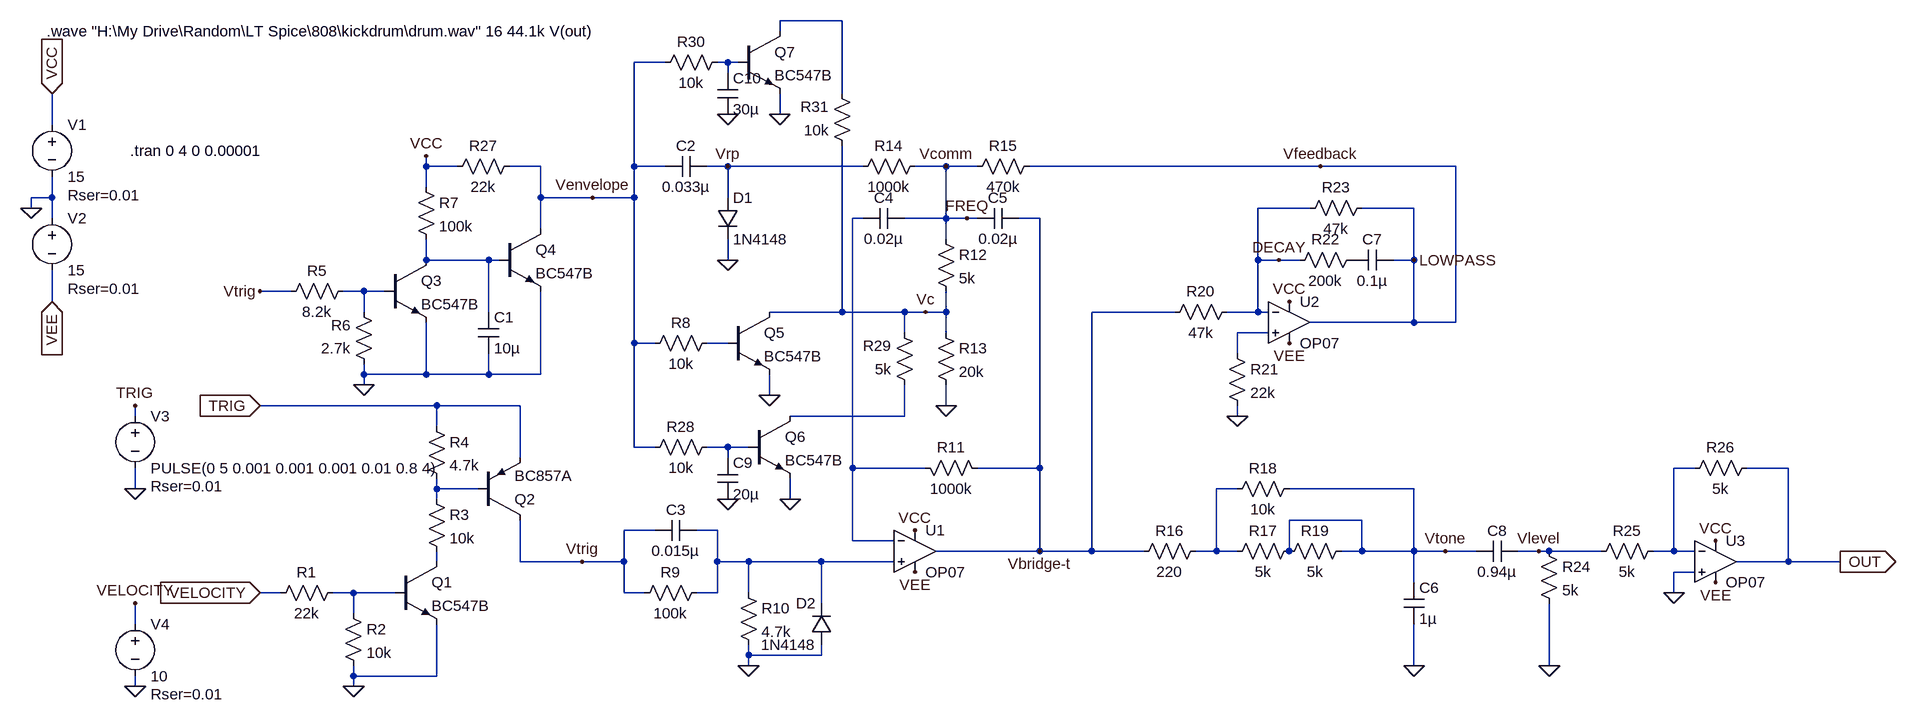
[diagram p0: schematic Drum.asc]
Drum.asc, the LTspice schematic file:
Version 4
SHEET 1 3084 1236
WIRE 1168 -80 1072 -80
WIRE 1072 -64 1072 -80
WIRE 896 -16 848 -16
WIRE 992 -16 976 -16
WIRE 1008 -16 992 -16
WIRE 992 0 992 -16
WIRE 1168 32 1168 -80
WIRE 1072 64 1072 32
WIRE -48 80 -48 32
WIRE 528 144 528 128
WIRE 576 144 528 144
WIRE 704 144 656 144
WIRE 848 144 848 -16
WIRE 896 144 848 144
WIRE 992 144 960 144
WIRE 1200 144 992 144
WIRE 1328 144 1280 144
WIRE 1376 144 1328 144
WIRE 1904 144 1456 144
WIRE 2112 144 1904 144
WIRE 528 176 528 144
WIRE -48 192 -48 160
WIRE -48 192 -80 192
WIRE 704 192 704 144
WIRE 784 192 704 192
WIRE 848 192 848 144
WIRE 848 192 784 192
WIRE 992 192 992 144
WIRE -80 208 -80 192
WIRE 1888 208 1808 208
WIRE 2048 208 1968 208
WIRE -48 224 -48 192
WIRE 1200 224 1184 224
WIRE 1328 224 1328 144
WIRE 1328 224 1264 224
WIRE 1360 224 1328 224
WIRE 1376 224 1360 224
WIRE 1472 224 1440 224
WIRE 704 240 704 192
WIRE 1328 256 1328 224
WIRE 528 288 528 256
WIRE 624 288 528 288
WIRE 640 288 624 288
WIRE 992 288 992 256
WIRE 1808 288 1808 208
WIRE 1840 288 1808 288
WIRE 1872 288 1840 288
WIRE 2048 288 2048 208
WIRE 2048 288 2016 288
WIRE 320 336 272 336
WIRE 432 336 400 336
WIRE 464 336 432 336
WIRE -48 352 -48 304
WIRE 432 368 432 336
WIRE 624 368 624 288
WIRE 1168 368 1168 112
WIRE 1168 368 1056 368
WIRE 1264 368 1168 368
WIRE 1296 368 1264 368
WIRE 1328 368 1328 336
WIRE 1328 368 1296 368
WIRE 1680 368 1552 368
WIRE 1808 368 1808 288
WIRE 1808 368 1760 368
WIRE 1824 368 1808 368
WIRE 2048 384 2048 288
WIRE 2048 384 1888 384
WIRE 2112 384 2112 144
WIRE 2112 384 2048 384
WIRE 1264 400 1264 368
WIRE 1328 400 1328 368
WIRE 1824 400 1776 400
WIRE 848 416 848 192
WIRE 880 416 848 416
WIRE 992 416 960 416
WIRE 1776 432 1776 400
WIRE 432 464 432 448
WIRE 528 464 528 384
WIRE 528 464 432 464
WIRE 624 464 624 432
WIRE 624 464 528 464
WIRE 704 464 704 336
WIRE 704 464 624 464
WIRE 432 480 432 464
WIRE 1056 496 1056 464
WIRE 544 512 272 512
WIRE 672 512 544 512
WIRE 1328 512 1328 480
WIRE 80 528 80 512
WIRE 1264 528 1264 480
WIRE 1264 528 1088 528
WIRE 1776 528 1776 512
WIRE 544 544 544 512
WIRE 848 576 848 416
WIRE 880 576 848 576
WIRE 992 576 960 576
WIRE 1024 576 992 576
WIRE 672 592 672 512
WIRE 992 592 992 576
WIRE 1184 608 1184 224
WIRE 1296 608 1184 608
WIRE 1472 608 1472 224
WIRE 1472 608 1376 608
WIRE 2480 608 2448 608
WIRE 2624 608 2560 608
WIRE 80 640 80 608
WIRE 544 640 544 624
WIRE 608 640 544 640
WIRE 1776 640 1744 640
WIRE 2048 640 1856 640
WIRE 544 656 544 640
WIRE 1088 656 1088 624
WIRE 1968 688 1856 688
WIRE 880 704 832 704
WIRE 976 704 944 704
WIRE 1184 720 1184 608
WIRE 1248 720 1184 720
WIRE 1472 736 1472 608
WIRE 1472 736 1312 736
WIRE 1552 736 1552 368
WIRE 1552 736 1472 736
WIRE 1632 736 1552 736
WIRE 1744 736 1744 640
WIRE 1744 736 1712 736
WIRE 1776 736 1744 736
WIRE 1856 736 1856 688
WIRE 1968 736 1968 688
WIRE 1968 736 1936 736
WIRE 2048 736 2048 640
WIRE 2048 736 1968 736
WIRE 2096 736 2048 736
WIRE 2144 736 2096 736
WIRE 2240 736 2208 736
WIRE 2256 736 2240 736
WIRE 2336 736 2256 736
WIRE 2448 736 2448 608
WIRE 2448 736 2416 736
WIRE 2480 736 2448 736
WIRE 544 752 544 736
WIRE 672 752 672 688
WIRE 768 752 672 752
WIRE 832 752 832 704
WIRE 832 752 768 752
WIRE 976 752 976 704
WIRE 1024 752 976 752
WIRE 1136 752 1024 752
WIRE 1248 752 1136 752
WIRE 2624 752 2624 608
WIRE 2624 752 2544 752
WIRE 2704 752 2624 752
WIRE 2480 768 2448 768
WIRE 2048 784 2048 736
WIRE 304 800 272 800
WIRE 416 800 384 800
WIRE 480 800 416 800
WIRE 832 800 832 752
WIRE 864 800 832 800
WIRE 976 800 976 752
WIRE 976 800 944 800
WIRE 1024 800 1024 752
WIRE 2448 800 2448 768
WIRE 1136 816 1136 752
WIRE 416 832 416 800
WIRE 80 848 80 816
WIRE 1024 896 1024 880
WIRE 1136 896 1136 880
WIRE 1136 896 1024 896
WIRE 1024 912 1024 896
WIRE 2048 912 2048 848
WIRE 2256 912 2256 816
WIRE 416 928 416 912
WIRE 544 928 544 848
WIRE 544 928 416 928
WIRE 80 944 80 928
WIRE 416 944 416 928
FLAG -48 352 VEE
IOPIN -48 352 In
FLAG -48 32 VCC
IOPIN -48 32 In
FLAG -80 208 0
FLAG 272 512 TRIG
IOPIN 272 512 In
FLAG 272 800 VELOCITY
IOPIN 272 800 In
FLAG 416 944 0
FLAG 768 752 Vtrig
FLAG 432 480 0
FLAG 272 336 Vtrig
FLAG 528 128 VCC
FLAG 784 192 Venvelope
FLAG 1056 496 0
FLAG 992 288 0
FLAG 992 144 Vrp
FLAG 1024 912 0
FLAG 1328 512 0
FLAG 1472 736 Vbridge-t
FLAG 2048 912 0
FLAG 1328 144 Vcomm
FLAG 1296 368 Vc
FLAG 1776 528 0
FLAG 1280 704 VCC
FLAG 1856 352 VCC
FLAG 1280 768 VEE
FLAG 1856 416 VEE
FLAG 2240 736 Vlevel
FLAG 2096 736 Vtone
FLAG 2704 752 OUT
IOPIN 2704 752 Out
FLAG 80 640 0
FLAG 80 512 TRIG
FLAG 80 944 0
FLAG 80 816 VELOCITY
FLAG 1904 144 Vfeedback
FLAG 2256 912 0
FLAG 2448 800 0
FLAG 2512 784 VEE
FLAG 2512 720 VCC
FLAG 1840 288 DECAY
FLAG 2048 288 LOWPASS
FLAG 1360 224 FREQ
FLAG 992 656 0
FLAG 1088 656 0
FLAG 1072 64 0
FLAG 992 64 0
SYMBOL voltage -48 64 R0
WINDOW 123 0 0 Left 2
WINDOW 39 24 124 Left 2
SYMATTR SpiceLine Rser=0.01
SYMATTR InstName V1
SYMATTR Value 15
SYMBOL voltage -48 208 R0
WINDOW 123 0 0 Left 2
WINDOW 39 24 124 Left 2
SYMATTR SpiceLine Rser=0.01
SYMATTR InstName V2
SYMATTR Value 15
SYMBOL res 400 784 R90
WINDOW 0 0 56 VBottom 2
WINDOW 3 32 56 VTop 2
SYMATTR InstName R1
SYMATTR Value 22k
SYMBOL res 400 816 R0
SYMATTR InstName R2
SYMATTR Value 10k
SYMBOL npn 480 752 R0
SYMATTR InstName Q1
SYMATTR Value BC547B
SYMBOL res 528 640 R0
SYMATTR InstName R3
SYMATTR Value 10k
SYMBOL res 528 528 R0
SYMATTR InstName R4
SYMATTR Value 4.7k
SYMBOL pnp 608 688 M180
SYMATTR InstName Q2
SYMATTR Value BC857A
SYMBOL res 416 320 R90
WINDOW 0 0 56 VBottom 2
WINDOW 3 32 56 VTop 2
SYMATTR InstName R5
SYMATTR Value 8.2k
SYMBOL res 448 464 R180
WINDOW 0 36 76 Left 2
WINDOW 3 36 40 Left 2
SYMATTR InstName R6
SYMATTR Value 2.7k
SYMBOL npn 464 288 R0
SYMATTR InstName Q3
SYMATTR Value BC547B
SYMBOL npn 640 240 R0
SYMATTR InstName Q4
SYMATTR Value BC547B
SYMBOL cap 608 368 R0
SYMATTR InstName C1
SYMATTR Value 10µ
SYMBOL res 512 160 R0
SYMATTR InstName R7
SYMATTR Value 100k
SYMBOL res 976 400 R90
WINDOW 0 0 56 VBottom 2
WINDOW 3 32 56 VTop 2
SYMATTR InstName R8
SYMATTR Value 10k
SYMBOL npn 992 368 R0
SYMATTR InstName Q5
SYMATTR Value BC547B
SYMBOL cap 960 128 R90
WINDOW 0 0 32 VBottom 2
WINDOW 3 32 32 VTop 2
SYMATTR InstName C2
SYMATTR Value 0.033µ
SYMBOL diode 976 192 R0
SYMATTR InstName D1
SYMATTR Value 1N4148
SYMBOL cap 944 688 R90
WINDOW 0 0 32 VBottom 2
WINDOW 3 32 32 VTop 2
SYMATTR InstName C3
SYMATTR Value 0.015µ
SYMBOL res 960 784 R90
WINDOW 0 0 56 VBottom 2
WINDOW 3 32 56 VTop 2
SYMATTR InstName R9
SYMATTR Value 100k
SYMBOL res 1008 784 R0
SYMATTR InstName R10
SYMATTR Value 4.7k
SYMBOL diode 1152 880 R180
WINDOW 0 24 64 Left 2
WINDOW 3 24 0 Left 2
SYMATTR InstName D2
SYMATTR Value 1N4148
SYMBOL Opamps\\OP07 1280 672 R0
SYMATTR InstName U1
SYMBOL res 1280 592 M90
WINDOW 0 0 56 VBottom 2
WINDOW 3 32 56 VTop 2
SYMATTR InstName R11
SYMATTR Value 1000k
SYMBOL cap 1264 208 R90
WINDOW 0 0 32 VBottom 2
WINDOW 3 32 32 VTop 2
SYMATTR InstName C4
SYMATTR Value 0.02µ
SYMBOL cap 1440 208 R90
WINDOW 0 0 32 VBottom 2
WINDOW 3 32 32 VTop 2
SYMATTR InstName C5
SYMATTR Value 0.02µ
SYMBOL res 1312 240 R0
SYMATTR InstName R12
SYMATTR Value 5k
SYMBOL res 1312 384 R0
SYMATTR InstName R13
SYMATTR Value 20k
SYMBOL res 1296 128 R90
WINDOW 0 0 56 VBottom 2
WINDOW 3 32 56 VTop 2
SYMATTR InstName R14
SYMATTR Value 1000k
SYMBOL res 1472 128 R90
WINDOW 0 0 56 VBottom 2
WINDOW 3 32 56 VTop 2
SYMATTR InstName R15
SYMATTR Value 470k
SYMBOL res 1728 720 R90
WINDOW 0 0 56 VBottom 2
WINDOW 3 32 56 VTop 2
SYMATTR InstName R16
SYMATTR Value 220
SYMBOL res 1872 720 R90
WINDOW 0 0 56 VBottom 2
WINDOW 3 32 56 VTop 2
SYMATTR InstName R17
SYMATTR Value 5k
SYMBOL res 1872 624 R90
WINDOW 0 0 56 VBottom 2
WINDOW 3 32 56 VTop 2
SYMATTR InstName R18
SYMATTR Value 10k
SYMBOL res 1952 720 R90
WINDOW 0 0 56 VBottom 2
WINDOW 3 32 56 VTop 2
SYMATTR InstName R19
SYMATTR Value 5k
SYMBOL cap 2032 784 R0
SYMATTR InstName C6
SYMATTR Value 1µ
SYMBOL res 1776 352 R90
WINDOW 0 0 56 VBottom 2
WINDOW 3 32 56 VTop 2
SYMATTR InstName R20
SYMATTR Value 47k
SYMBOL Opamps\\OP07 1856 320 R0
SYMATTR InstName U2
SYMBOL res 1760 416 R0
SYMATTR InstName R21
SYMATTR Value 22k
SYMBOL res 1968 272 R90
WINDOW 0 0 56 VBottom 2
WINDOW 3 32 56 VTop 2
SYMATTR InstName R22
SYMATTR Value 200k
SYMBOL cap 2016 272 R90
WINDOW 0 0 32 VBottom 2
WINDOW 3 32 32 VTop 2
SYMATTR InstName C7
SYMATTR Value 0.1µ
SYMBOL res 1984 192 R90
WINDOW 0 0 56 VBottom 2
WINDOW 3 32 56 VTop 2
SYMATTR InstName R23
SYMATTR Value 47k
SYMBOL cap 2208 720 R90
WINDOW 0 0 32 VBottom 2
WINDOW 3 32 32 VTop 2
SYMATTR InstName C8
SYMATTR Value 0.94µ
SYMBOL res 2240 720 R0
SYMATTR InstName R24
SYMATTR Value 5k
SYMBOL voltage 80 512 R0
WINDOW 123 0 0 Left 2
WINDOW 39 24 124 Left 2
SYMATTR SpiceLine Rser=0.01
SYMATTR InstName V3
SYMATTR Value PULSE(0 5 0.001 0.001 0.001 0.01 0.8 4)
SYMBOL voltage 80 832 R0
WINDOW 123 0 0 Left 2
WINDOW 39 24 124 Left 2
SYMATTR SpiceLine Rser=0.01
SYMATTR InstName V4
SYMATTR Value 10
SYMBOL Opamps\\OP07 2512 688 R0
SYMATTR InstName U3
SYMBOL res 2432 720 R90
WINDOW 0 0 56 VBottom 2
WINDOW 3 32 56 VTop 2
SYMATTR InstName R25
SYMATTR Value 5k
SYMBOL res 2576 592 R90
WINDOW 0 0 56 VBottom 2
WINDOW 3 32 56 VTop 2
SYMATTR InstName R26
SYMATTR Value 5k
SYMBOL res 672 128 R90
WINDOW 0 0 56 VBottom 2
WINDOW 3 32 56 VTop 2
SYMATTR InstName R27
SYMATTR Value 22k
SYMBOL npn 1024 528 R0
SYMATTR InstName Q6
SYMATTR Value BC547B
SYMBOL res 976 560 R90
WINDOW 0 0 56 VBottom 2
WINDOW 3 32 56 VTop 2
SYMATTR InstName R28
SYMATTR Value 10k
SYMBOL cap 976 592 R0
SYMATTR InstName C9
SYMATTR Value 20µ
SYMBOL res 1280 496 R180
WINDOW 0 36 76 Left 2
WINDOW 3 36 40 Left 2
SYMATTR InstName R29
SYMATTR Value 5k
SYMBOL res 992 -32 R90
WINDOW 0 0 56 VBottom 2
WINDOW 3 32 56 VTop 2
SYMATTR InstName R30
SYMATTR Value 10k
SYMBOL npn 1008 -64 R0
SYMATTR InstName Q7
SYMATTR Value BC547B
SYMBOL res 1184 128 R180
WINDOW 0 36 76 Left 2
WINDOW 3 36 40 Left 2
SYMATTR InstName R31
SYMATTR Value 10k
SYMBOL cap 976 0 R0
SYMATTR InstName C10
SYMATTR Value 30µ
TEXT -56 -64 Left 2 !.wave "H:\\My Drive\\Random\\LT Spice\\808\\kickdrum\\drum.wav" 16 44.1k V(out)
TEXT 72 120 Left 2 !.tran 0 4 0 0.00001

The netlist it stands for:
* Drum.asc
V1 VCC 0 15 Rser=0.01
V2 0 VEE 15 Rser=0.01
R1 N015 VELOCITY 22k
R2 N015 0 10k
Q1 N014 N015 0 0 BC547B
R3 N011 N014 10k
R4 TRIG N011 4.7k
Q2 Vtrig N011 TRIG 0 BC857A
R5 N005 Vtrig 8.2k
R6 0 N005 2.7k
Q3 N004 N005 0 0 BC547B
Q4 Venvelope N004 0 0 BC547B
C1 N004 0 10µ
R7 VCC N004 100k
R8 N007 Venvelope 10k
Q5 Vc N007 0 0 BC547B
C2 Vrp Venvelope 0.033µ
D1 Vrp 0 1N4148
C3 N013 Vtrig 0.015µ
R9 N013 Vtrig 100k
R10 N013 0 4.7k
D2 0 N013 1N4148
XU1 N013 N003 VCC VEE Vbridge-t LT1001  ; OP07, pins In+ In- V+ V- OUT
R11 N003 Vbridge-t 1000k
C4 FREQ N003 0.02µ
C5 Vbridge-t FREQ 0.02µ
R12 FREQ Vc 5k
R13 Vc 0 20k
R14 FREQ Vrp 1000k
R15 LOWPASS FREQ 470k
R16 N012 Vbridge-t 220
R17 Vtone N012 5k
R18 Vtone N012 10k
R19 Vtone Vtone 5k
C6 Vtone 0 1µ
R20 DECAY Vbridge-t 47k
XU2 N006 DECAY VCC VEE LOWPASS LT1001  ; OP07, pins In+ In- V+ V- OUT
R21 N006 0 22k
R22 P001 DECAY 200k
C7 LOWPASS P001 0.1µ
R23 LOWPASS DECAY 47k
C8 Vlevel Vtone 0.94µ
R24 Vlevel 0 5k
V3 TRIG 0 PULSE(0 5 0.001 0.001 0.001 0.01 0.8 4) Rser=0.01
V4 VELOCITY 0 10 Rser=0.01
XU3 0 N010 VCC VEE OUT LT1001  ; OP07, pins In+ In- V+ V- OUT
R25 N010 Vlevel 5k
R26 OUT N010 5k
R27 Venvelope VCC 22k
Q6 N008 N009 0 0 BC547B
R28 N009 Venvelope 10k
C9 N009 0 20µ
R29 N008 Vc 5k
R30 N002 Venvelope 10k
Q7 N001 N002 0 0 BC547B
R31 Vc N001 10k
C10 N002 0 30µ
.model D D
.lib standard.dio
.model NPN NPN
.model PNP PNP
.lib standard.bjt
.wave "H:\My Drive\Random\LT Spice\808\kickdrum\drum.wav" 16 44.1k V(out)
.tran 0 4 0 0.00001
.lib LTC.lib
.backanno
.end